# EAGLE design TouchSensor_WGP (EAGLE 9.6.2)
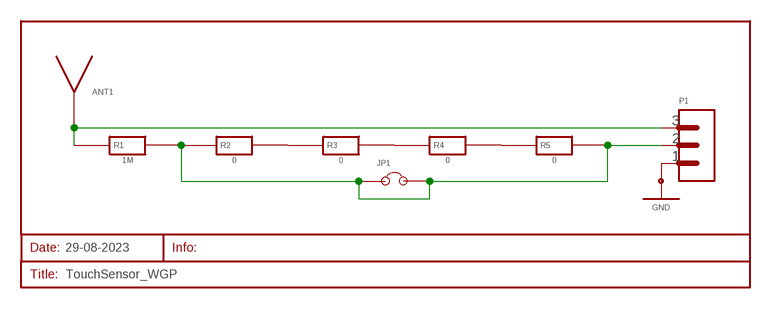
[diagram p0: schematic, sheet 1]

## Parts
JP1  JUMPER_2-WAY_PCB_B  [PCB_JUMPER_2-WAY_B]
P1  PORT_3_PIN_HEADER  [HEADER_3_PIN]
R1  1M  RESISTOR  [RESISTOR_10.16MM]
R2  0  RESISTOR  [RESISTOR_10.16MM]
R3  0  RESISTOR  [RESISTOR_10.16MM]
R4  0  RESISTOR  [RESISTOR_10.16MM]
R5  0  RESISTOR  [RESISTOR_10.16MM]
SCHEMATIC1  29-08-2023  SHEET  [SHEET]

## Nets
ANT: P1.3 R1.1
GND: P1.1
N$2: R2.2 R3.1
N$3: R3.2 R4.1
N$4: R4.2 R5.1
N$5: JP1.1 JP1.2 P1.2 R1.2 R2.1 R5.2

## Library data of the parts
JP1 = myLibrary:JUMPER_2-WAY
P1 = myLibrary:PORT_3_PIN
R1-R5 = myLibrary:RESISTOR
SCHEMATIC1 = myLibrary:SHEET

## Board
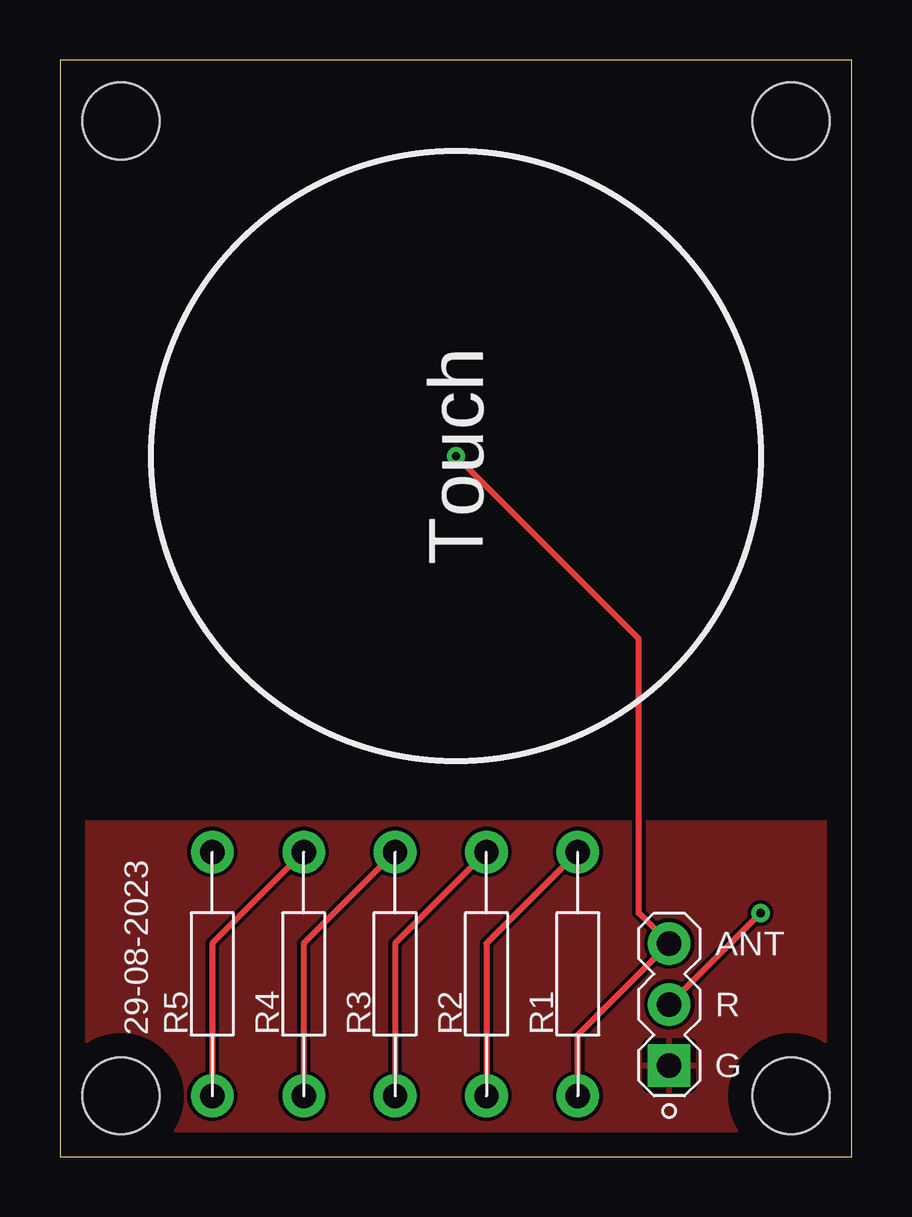
[diagram p1: board, top side]
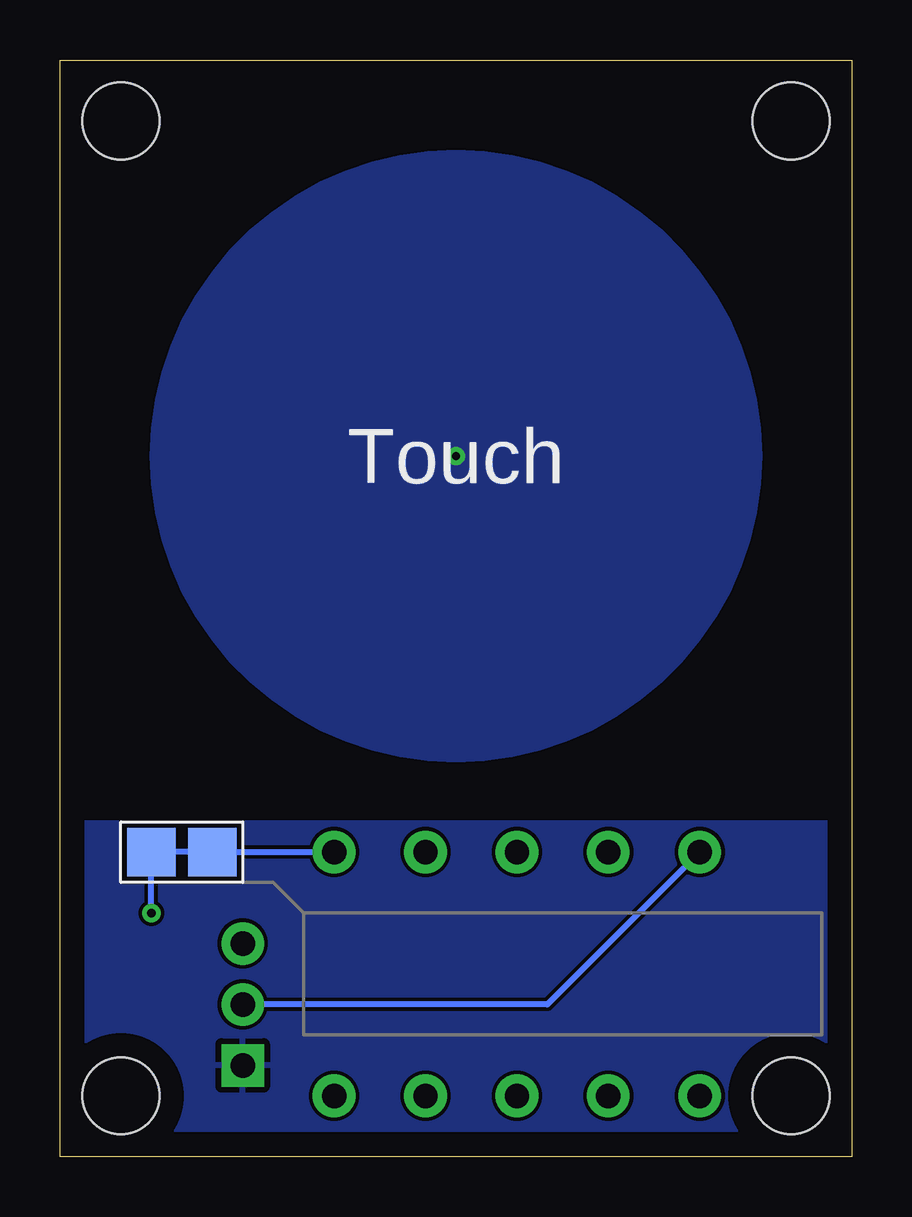
[diagram p2: board, bottom side, seen from below]

Size 33.02 x 45.72 mm. Coordinates in mm from the lower left corner, seen from the top.
Outline: 0,0 33.02,0 33.02,45.72 0,45.72 0,0
Copper layers (1*16): Top 0.035mm / dielectric 1.5mm / Bottom 0.035mm
Design rules "default": minimum track width 6mil, minimum drill 0.35mm, track to track 6mil, track to pad 6mil, pad to pad 6mil, via to via 6mil, smd to smd 6mil, copper to edge 40mil, drill to drill 6mil, minimum pad ring 10mil, minimum via ring 8mil, stop-mask expansion 4mil, vias tented up to drill 0mil, thermal gap 10mil
Holes 3.2 mm at 2.54,2.54 30.48,2.54 2.54,43.18 30.48,43.18

### Footprints (pad centres in the part's own frame; a part is rotated, then mirrored left to right if it is on the bottom)
PCB_JUMPER_2-WAY_B = smd 2.032 x 2.032 bottom: 1 -1.27,0; 2 1.27,0
HEADER_3_PIN = drill 1.016 pad 1.778 square: 1 0,0 | drill 1.016 pad 1.778: 2 0,2.54; 3 0,5.08
RESISTOR_10.16MM = drill 1.016 pad 1.778: 1 -5.08,0; 2 5.08,0

### Placement (x,y rotation side)
JP1  27.94,12.7 0 top
P1  25.4,3.81 0 top
R1  21.59,7.62 90 top
R2  17.78,7.62 90 top
R3  13.97,7.62 90 top
R4  10.16,7.62 90 top
R5  6.35,7.62 90 top
SCHEMATIC1  3.17,5.08 90 top

### Tracks (layer width: path | path; a pad name or v marks a point on that pad's centre or on a via)
ANT  (via drill 0.35)
  Top 0.254: R1.1 21.59,5.08 P1.3 24.13,10.16 24.13,21.59 v16.51,29.21
  pour Bottom: 16.51,41.91 arc-90 29.21,29.21 arc-90 16.51,16.51 arc-90 3.81,29.21 arc-90
GND
  pour Bottom: -2.54,13.97 -2.54,-2.54 35.56,-2.54 35.56,13.97
  cutout Bottom: 25.4,13.97 25.4,11.43 30.48,11.43 30.48,13.97
  pour Top: -2.54,13.97 -2.54,-2.54 35.56,-2.54 35.56,13.97
N$2
  Top 0.254: R2.2 13.97,8.89 R3.1
N$3
  Top 0.254: R3.2 10.16,8.89 R4.1
N$4
  Top 0.254: R4.2 6.35,8.89 R5.1
N$5  (via drill 0.35)
  Top 0.254: R1.2 17.78,8.89 R2.1 | P1.2 v29.21,10.16
  Bottom 0.254: R1.2 JP1.1 JP1.2 v29.21,10.16 | R5.2 12.7,6.35 P1.2

### Text on the board
tPlace: Touch | ANT | R | G
bPlace: Touch
bDocu: Cut jumper to use R2-5 / Do not populate unless cut.